# Altium schematic sheet Sheet_1_2021-06-21.schdoc
size 213 x 103 mm
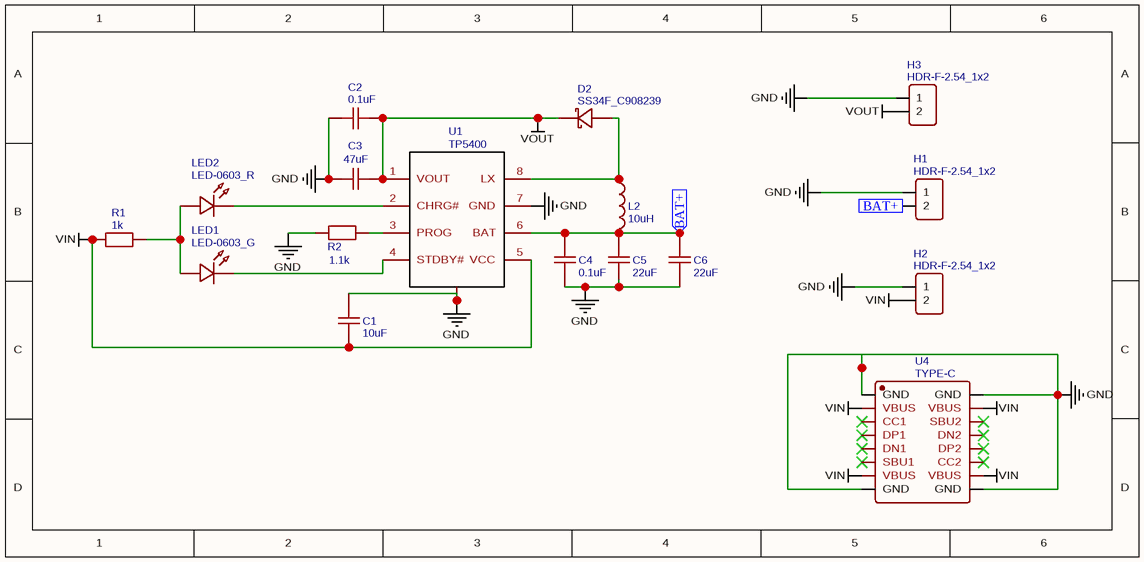
[diagram p0: Sheet_1_2021-06-21.schdoc]

## Parts
C1  10uF  [C0603]
C2  0.1uF  [C0603]
C3  47uF  [C1206]
C4  0.1uF  [C0603]
C5  22uF  [C0603]
C6  22uF  [C0603]
D2  SS34F_C908239  [SMAF_L3.5-W2.6-LS4.7-FD]
H1  HDR-F-2.54_1x2  [HDR-F-2.54_1X2]
H2  HDR-F-2.54_1x2  [HDR-F-2.54_1X2]
H3  HDR-F-2.54_1x2  [HDR-F-2.54_1X2]
L2  10uH  [IND-SMD_L7.0-W6.6]
LED1  LED-0603_G  [LED0603_GREEN]
LED2  LED-0603_R  [LED0603_RED]
R1  1k  [R0603]
R2  1.1k  [R0603]
U1  TP5400  [SOIC-8_L5.0-W4.0-P1.27-LS6.0-BL-EP]
U4  TYPE-C  [TYPEC-16PIN-四角贴板]

## Ports
BAT+ (in)

## Nets
GND: C1.1 C2.1 C3.1 C4.2 C5.2 C6.2 H1.1 H2.1 H3.1 R2.1 U1.7(GND) U1.9 U4.A1/B12(GND) U4.B1/A12(GND)
VIN: C1.2 H2.2 R1.1 U1.5(VCC) U4.A4/B9(VBUS) U4.B4/A9(VBUS)
VOUT: C2.2 C3.2 D2.2(K) H3.2 U1.1(VOUT)
BAT+: C4.1 C5.1 C6.1 H1.2 L2.2 U1.6(BAT) ; port BAT+
NetD2_1: D2.1(A) L2.1 U1.8(LX)
NetLED1_1: LED1.1 LED2.1 R1.2
NetLED1_2: LED1.2 U1.4(STDBY#)
NetLED2_2: LED2.2 U1.2(CHRG#)
NetR2_2: R2.2 U1.3(PROG)

Not connected (* = marked no-connect by the designer): U4 A5(CC1)* A6(DP1)* A7(DN1)* A8(SBU1)* B5(CC2)* B6(DP2)* B7(DN2)* B8(SBU2)*

## Library data of the parts
C1 = 10uF: nameAlias: Value(F); Contributor: LCEDA_Lib; spicePre: C; spiceSymbolName: C_0603_US
C2 C4 = 0.1uF: nameAlias: Value(F); Contributor: LCEDA_Lib; spicePre: C; spiceSymbolName: C_0603_US
C3 = 47uF: nameAlias: Value(F); Contributor: LCEDA_Lib; spicePre: C; spiceSymbolName: C_1206_US
C5 C6 = 22uF: nameAlias: Value(F); Contributor: LCEDA_Lib; spicePre: C; spiceSymbolName: C_0603_US
D2 = SS34F_C908239: BOM_Manufacturer: FUXINSEMI; BOM_Manufacturer Part: SS34F; Contributor: LCSC; BOM_Supplier: LCSC; BOM_Supplier Part: C908239; spicePre: D; spiceSymbolName: SS34F_C908239
H1-H3 = HDR-F-2.54_1x2: Contributor: LCEDA_Lib; BOM_Supplier Part: C49661; BOM_Supplier: LCSC; spicePre: H; spiceSymbolName: HDR-F-2.54_1x2
L2 = 10uH: BOM_Manufacturer: cjiang; BOM_Manufacturer Part: FXL0630-100-M; nameAlias: Inductance; Contributor: LCSC; BOM_Paste Type: expand; BOM_Supplier: LCSC; BOM_Supplier Part: C167223; spicePre: L; spiceSymbolName: FXL0630-100-M
LED1 = LED-0603_G: BOM_Manufacturer: EVERLIGHT(台湾亿光); BOM_Manufacturer Part: 19-217/GHC-YR1S2/3T; Contributor: LCEDA_Lib; BOM_Supplier Part: C72043; BOM_Supplier: LCSC; spicePre: L; spiceSymbolName: LED-0603_G
LED2 = LED-0603_R: BOM_Manufacturer: EVERLIGHT(台湾亿光); BOM_Manufacturer Part: 19-217/R6C-AL1M2VY/3T; Contributor: LCEDA_01; BOM_Supplier Part: C72044; BOM_Supplier: LCSC; spicePre: L; spiceSymbolName: LED-0603_R
R1 = 1k: nameAlias: Value(Ω); Contributor: LCEDA_Lib; spicePre: R; spiceSymbolName: R_0603_EU
R2 = 1.1k: nameAlias: Value(Ω); Contributor: LCEDA_Lib; spicePre: R; spiceSymbolName: R_0603_EU
U1 = TP5400: BOM_Manufacturer: TOPPOWER; BOM_Supplier: LCSC; BOM_Manufacturer Part: TP5400; BOM_Supplier Part: C24154; BOM_JLCPCB Part Class: Extended Part; spicePre: U; spiceSymbolName: TP5400
U4 = TYPE-C: Contributor: WQM_Editor; spicePre: U; spiceSymbolName: TYPE-C